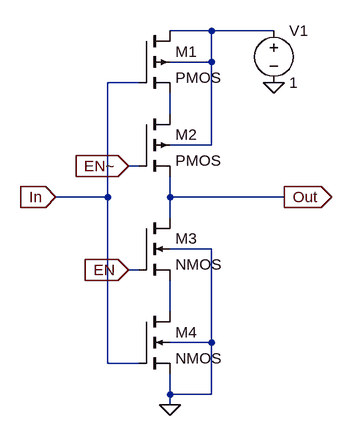
[diagram p0: schematic TriState.asc]
TriState.asc, the LTspice schematic file:
Version 4
SHEET 1 880 680
WIRE 288 48 224 48
WIRE 384 48 288 48
WIRE 288 96 288 48
WIRE 288 96 224 96
WIRE 176 128 128 128
WIRE 224 176 224 144
WIRE 288 224 288 96
WIRE 288 224 224 224
WIRE 176 256 160 256
WIRE 128 304 128 128
WIRE 128 304 48 304
WIRE 224 304 224 272
WIRE 400 304 224 304
WIRE 224 336 224 304
WIRE 288 384 224 384
WIRE 176 416 160 416
WIRE 224 480 224 432
WIRE 288 528 288 384
WIRE 288 528 224 528
WIRE 128 560 128 304
WIRE 176 560 128 560
WIRE 224 608 224 576
WIRE 288 608 288 528
WIRE 288 608 224 608
WIRE 224 624 224 608
FLAG 384 128 0
FLAG 224 624 0
FLAG 48 304 In
IOPIN 48 304 In
FLAG 400 304 Out
IOPIN 400 304 Out
FLAG 160 256 EN~
IOPIN 160 256 In
FLAG 160 416 EN
IOPIN 160 416 In
SYMBOL pmos4 176 48 R0
SYMATTR InstName M1
SYMATTR Value2 l=130n w=4u
SYMBOL pmos4 176 176 R0
SYMATTR InstName M2
SYMATTR Value2 l=130n w=4u
SYMBOL nmos4 176 336 R0
SYMATTR InstName M3
SYMATTR Value2 l=130n w=2u
SYMBOL nmos4 176 480 R0
SYMATTR InstName M4
SYMATTR Value2 l=130n w=2u
SYMBOL voltage 384 32 R0
WINDOW 123 0 0 Left 0
WINDOW 39 0 0 Left 0
SYMATTR InstName V1
SYMATTR Value 1

The netlist it stands for:
* TriState.asc
M1 N001 In N002 N001 PMOS l=130n w=4u
M2 N002 EN~ Out N001 PMOS l=130n w=4u
M3 Out EN N003 0 NMOS l=130n w=2u
M4 N003 In 0 0 NMOS l=130n w=2u
V1 N001 0 1
.model NMOS NMOS
.model PMOS PMOS
.lib standard.mos
.backanno
.end